# Altium schematic sheet Source.SchDoc
size A; SheetNumber: 2; SheetTotal: 5
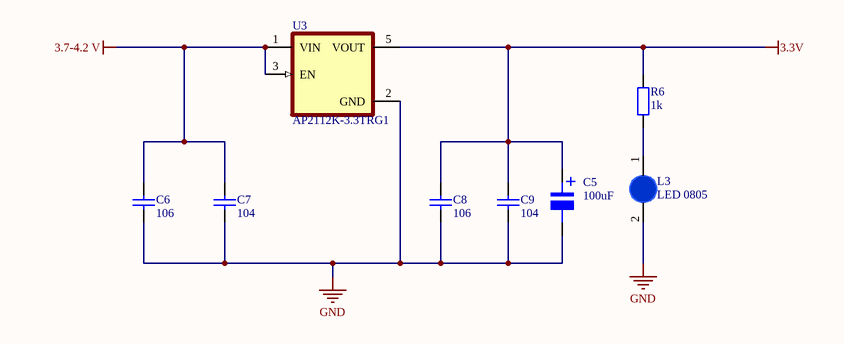
[diagram p0: Source.SchDoc]

## Parts
C5  100uF  [tu nhom 6.3 (d)]
C6  106  [tu 0805]
C7  104  [tu 0805]
C8  106  [tu 0805]
C9  104  [tu 0805]
L3  LED 0805  [LED-0805-Blue]
R6  1k  [tro smd 0805]
U3  AP2112K-3.3TRG1  [SOT95P285X140-5N]

## Nets
3.3V: C5.1 C8.1 C9.1 R6.2 U3.5(VOUT)
3.7-4.2 V: C6.1 C7.1 U3.1(VIN) U3.3(EN)
GND: C5.2 C6.2 C7.2 C8.2 C9.2 L3.2(K) U3.2(GND)
NetL3_1: L3.1(A) R6.1

## Notes on the sheet
- (in symbol Tu Nhom 100uF 16V) +

## Library data of the parts
C5 = Tu Nhom 100uF 16V: Dán; Don_Vi: Con; So_Chan: 2; Ten_Linh_Kien: Tụ Nhôm 100uF 16V 6.3x5.4MM; Ma_Hang: MH002219; Chung_Loai: Dán; Kieu_Chan: *
C6-C9 = Tu 0805 106 16V 10%: Dán; Ten_Linh_Kien: Tụ 0805 106-10uF 10% 16V; So_Chan: 2; Don_Vi: Con; Ma_Hang: MH004553; Chung_Loai: Dán; Kieu_Chan: *
L3 = LED 0805 Xanh Duong: Dán; Don_Vi: Con; Ma_Hang: MH002327; Ten_Linh_Kien: LED 0805 Màu Xanh Dương (Blue); Ghi_Chu: *; Kieu_Chan: *; Chung_Loai: Dán
R6 = Tro 0805 5% 1k: Dán; Don_Vi: Con; So_Chan: 2; Ten_Linh_Kien: Trở 0805 5% 1k; Ma_Hang: MH005234; Chung_Loai: Dán; Kieu_Chan: *
U3 = AP2112K-3.3TRG1: Linear Voltage Regulator IC Positive Fixed 1 Output 600mA SOT-25; MF: Diodes Inc.; Value: *; Purchase-URL: https://pricing.snapeda.com/search/part/AP2112K-3.3TRG1/?ref=eda; Package: SOT-753 Diodes Inc.; Availability: In Stock; Check_prices: https://www.snapeda.com/parts/AP2112K-3.3TRG1/Diodes+Inc./view-part/?ref=eda; Price: None; SnapEDA_Link: https://www.snapeda.com/parts/AP2112K-3.3TRG1/Diodes+Inc./view-part/?ref=snap; MP: AP2112K-3.3TRG1